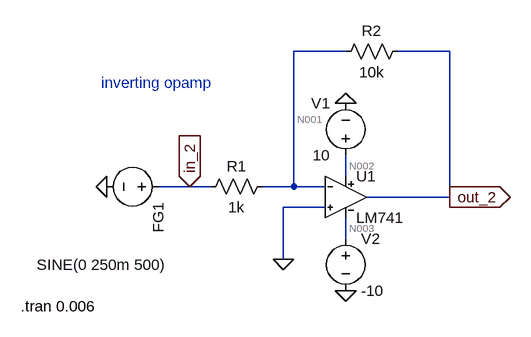
[diagram p0: schematic inverting_op.asc]
inverting_op.asc, the LTspice schematic file:
Version 4
SHEET 1 880 680
WIRE 16 -320 -64 -320
WIRE 176 -320 96 -320
WIRE 16 -128 16 -160
WIRE -224 -112 -272 -112
WIRE -192 -112 -224 -112
WIRE -64 -112 -64 -320
WIRE -64 -112 -112 -112
WIRE -16 -112 -64 -112
WIRE 176 -96 176 -320
WIRE 176 -96 48 -96
WIRE -16 -80 -80 -80
WIRE 16 -32 16 -64
WIRE -80 0 -80 -80
FLAG 16 -240 0
FLAG 16 48 0
FLAG -352 -112 0
FLAG 176 -96 out_2
IOPIN 176 -96 Out
FLAG -80 0 0
FLAG -224 -112 in_2
IOPIN -224 -112 In
SYMBOL voltage 16 -144 R180
WINDOW 0 24 96 Left 2
WINDOW 3 24 16 Left 2
WINDOW 123 0 0 Left 2
WINDOW 39 0 0 Left 2
SYMATTR InstName V1
SYMATTR Value 10
SYMBOL voltage 16 -48 R0
WINDOW 123 0 0 Left 2
WINDOW 39 0 0 Left 2
SYMATTR InstName V2
SYMATTR Value -10
SYMBOL voltage -256 -112 R90
WINDOW 3 120 3 VRight 2
WINDOW 123 0 0 Left 2
WINDOW 39 0 0 Left 2
SYMATTR Value SINE(0 250m 500)
SYMATTR InstName FG1
SYMBOL res -208 -96 R270
WINDOW 0 32 56 VTop 2
WINDOW 3 0 56 VBottom 2
SYMATTR InstName R1
SYMATTR Value 1k
SYMBOL res 0 -304 R270
WINDOW 0 32 56 VTop 2
WINDOW 3 0 56 VBottom 2
SYMATTR InstName R2
SYMATTR Value 10k
SYMBOL LM741 16 -160 R0
SYMATTR InstName U1
TEXT -360 -272 Left 2 ;inverting opamp
TEXT -484 72 Left 2 !.tran 0.006

The netlist it stands for:
* inverting_op.asc
V1 N002 0 10
V2 N003 0 -10
V§FG1 in_2 0 SINE(0 250m 500)
R1 in_2 N001 1k
R2 N001 out_2 10k
XU1 0 N001 N002 N003 out_2 LM741  ; pins In+ In- V+ V- OUT
* inverting opamp
.tran 0.006
.lib LM741.lib
.backanno
.end

* Results of the author's LTspice run, read from the files saved beside the schematic
* Operating Point, zero values left out:
*   V(n002) = 10 V
*   V(n003) = -10 V
*   V(n001) = 1 mV
*   V(out_2) = 12.02 mV
*   I(R2) = -1.102 µA
*   I(R1) = -1 µA
*   I(Fg1) = 1 µA
*   I(V2) = 1.576 mA
*   I(V1) = -1.577 mA
*   Ix(u1:1) = 57.86 nA
*   Ix(u1:2) = 101.9 nA
*   Ix(u1:99) = 1.577 mA
*   Ix(u1:50) = -1.576 mA
*   Ix(u1:28) = -1.102 µA